# Altium schematic sheet StreamDeck_alimentacion-V0.SchDoc: Alimentacion - Stream Deck
size A4; ApprovedBy: Guido Glorioso; CheckedBy: Guido Glorioso; Author: Guido Glorioso; CompanyName: UTN; DrawnBy: Guido Glorioso; Engineer: Guido Glorioso; Organization: UTN; Revision: 0; SheetNumber: 2; SheetTotal: 5
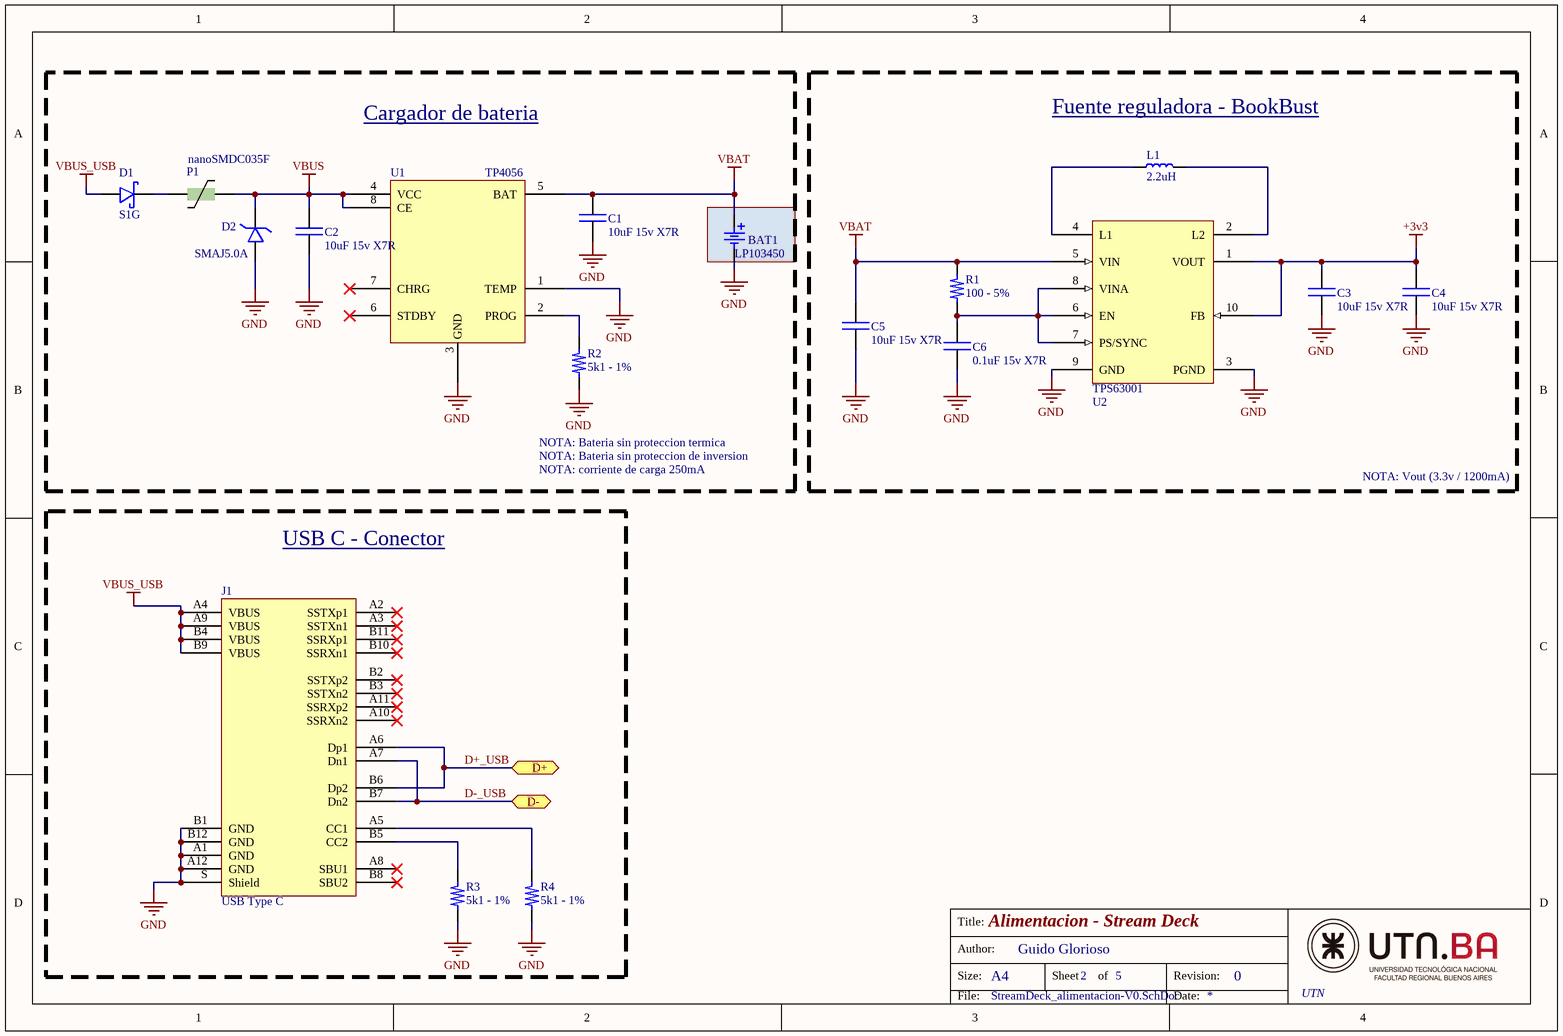
[diagram p0: StreamDeck_alimentacion-V0.SchDoc]

## Parts
BAT1  LP103450  [BAT-PAD-CONECTOR]
C1  10uF 15v X7R  [C_0805]
C2  10uF 15v X7R  [C_1206]
C3  10uF 15v X7R  [C_0805]
C4  10uF 15v X7R  [C_0805]
C5  10uF 15v X7R  [C_0805]
C6  0.1uF 15v X7R  [C_0805]
D1  S1G  [D_SMA]
D2  SMAJ5.0A  [D_SMA]
J1  USB Type C  [USB-C]
L1  2.2uH  [LQH44]
P1  nanoSMDC035F  [NANOSMDC]
R1  100 - 5%  [R_0805]
R2  5k1 - 1%  [R_0805]
R3  5k1 - 1%  [R_0805]
R4  5k1 - 1%  [R_0805]
U1  TP4056  [SOP8 - IPC]
U2  TPS63001  [VSON - 10]

## Blocks framed on the sheet
Cargador de bateria: BAT1 C1 C2 D1 D2 P1 R2 U1
Fuente reguladora - BookBust: C3-C6 L1 R1 U2
USB C - Conector: J1 R3 R4

## Ports
D+ (bidir, see StreamDeck_BLK-V0[2B], StreamDeck_CPU2-V0[1B]), D- (bidir, see StreamDeck_BLK-V0[2B], StreamDeck_CPU2-V0[1A])

## Nets
+3v3: C3.1 C4.1 U2.1(VOUT) U2.10(FB)
GND: BAT1.2 C1.2 C2.2 C3.2 C4.2 C5.2 C6.2 D2.1(anodo) J1.A1(GND) J1.A12(GND) J1.B1(GND) J1.B12(GND) J1.S(Shield) R2.1 R3.1 R4.1 U1.1(TEMP) U1.3(GND) U2.3(PGND) U2.9(GND)
VBAT: BAT1.1 C1.1 C5.1 R1.2 U1.5(BAT) U2.5(VIN)
VBUS: C2.1 D2.2(catodo) P1.2 U1.4(VCC) U1.8(CE)
VBUS_USB: D1.1(anodo) J1.A4(VBUS) J1.A9(VBUS) J1.B4(VBUS) J1.B9(VBUS)
D+_USB: J1.A6(Dp1) J1.B6(Dp2) ; port D+
D-_USB: J1.A7(Dn1) J1.B7(Dn2) ; port D-
NetC6_1: C6.1 R1.1 U2.6(EN) U2.7(PS/SYNC) U2.8(VINA)
NetD1_2: D1.2 P1.1
NetJ1_A5: J1.A5(CC1) R4.2
NetJ1_B5: J1.B5(CC2) R3.2
NetL1_1: L1.1 U2.4(L1)
NetL1_2: L1.2 U2.2(L2)
NetR2_2: R2.2 U1.2(PROG)

Not connected (* = marked no-connect by the designer): J1 A2(SSTXp1)* A3(SSTXn1)* A8(SBU1)* A10(SSRXn2)* A11(SSRXp2)* B2(SSTXp2)* B3(SSTXn2)* B8(SBU2)* B10(SSRXn1)* B11(SSRXp1)*; U1 6(STDBY)* 7(CHRG)*

## Notes on the sheet
- NOTA: Bateria sin proteccion termica
- NOTA: corriente de carga 250mA
- NOTA: Bateria sin proteccion de inversion
- NOTA: Vout (3.3v / 1200mA)
- Title:
- Size:
- Author:
- A4
- Sheet
- of
- Revision:
- File:
- Date:

## Library data of the parts
BAT1 = LP103450: Bateria LiPo LP103450 - 3.7v - 1800mAh - 900mA corriente maxima de carga. Proteccion de descarga, temperatura y sobrecarga
C1-C6 = Capacitor NP: Capacitor no polarizado
D1 = Diodo Schottky
D2 = Diodo TVS
J1 = USB-C: Conector USB C 3.0
L1 = Inductor: Inductor - SMD LQH44 - 1Amp
P1 = Poly Switch
R1-R4 = Resistor
U1 = TP4056: Standalone Linear Li-lon Battery Charger with Thermal Regulation in SOP-8
U2 = TPS63001: High-Efficient Single Inductor Buck-Boost Converter With 1.8-A Switches